# EAGLE design io (EAGLE 7.1.0)
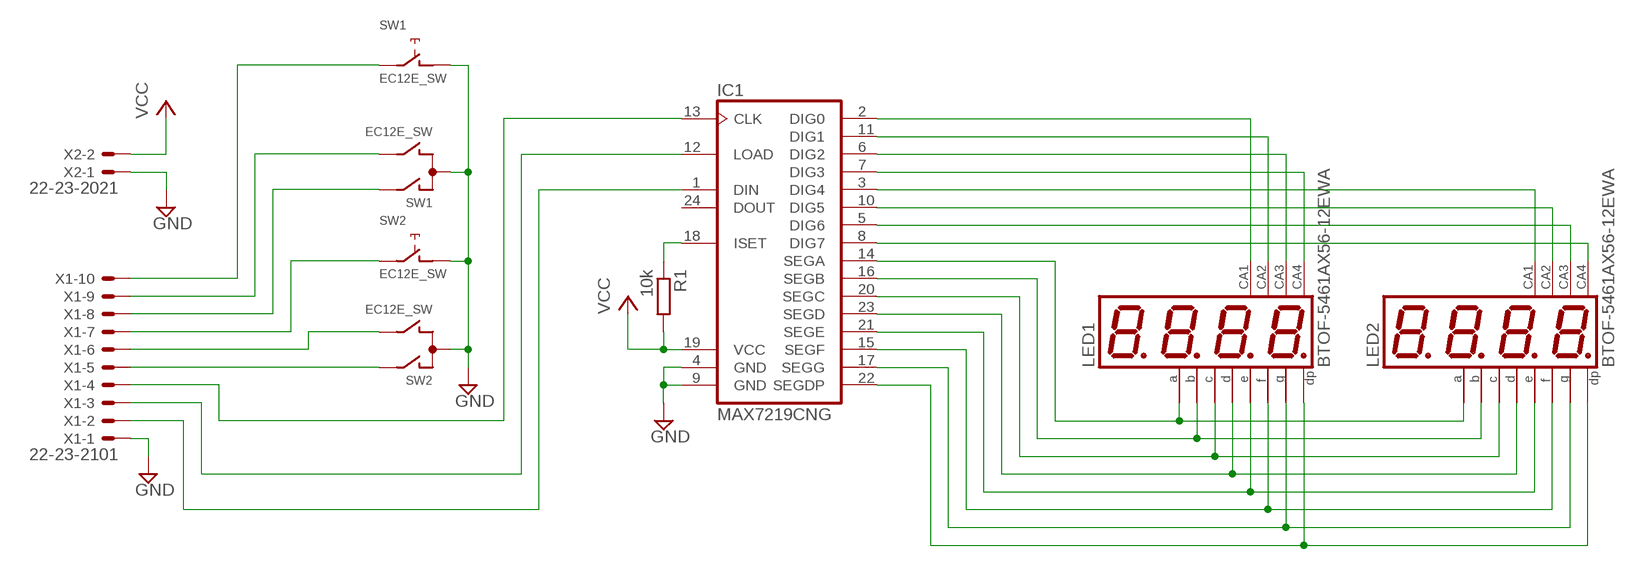
[diagram p0: schematic, sheet 1]

## Parts
IC1  MAX7219CNG  [DIL24-3]
LED1  BTOF-5461AX56-12EWA  [BX56-12]
LED2  BTOF-5461AX56-12EWA  [BX56-12]
R1  10k  R-EU_0207/10  [0207/10]
SW1  EC12E_SW  [ALPS_EC12E_SW]
SW2  EC12E_SW  [ALPS_EC12E_SW]
X1  22-23-2101  [22-23-2101]
X2  22-23-2021  [22-23-2021]

## Nets
GND: IC1.4(GND) IC1.9(GND) SW1.C SW1.D SW2.C SW2.D X1.1 X2.1
N$1: IC1.12(LOAD) X1.3
N$2: IC1.2(DIG0) LED1.12(CA)
N$3: IC1.11(DIG1) LED1.9(CA)
N$4: IC1.6(DIG2) LED1.8(CA)
N$6: IC1.3(DIG4) LED2.12(CA)
N$8: IC1.5(DIG6) LED2.8(CA)
N$9: IC1.8(DIG7) LED2.6(CA)
N$11: IC1.16(SEGB) LED1.7(B) LED2.7(B)
N$12: IC1.20(SEGC) LED1.4(C) LED2.4(C)
N$13: IC1.23(SEGD) LED1.2(D) LED2.2(D)
N$14: IC1.21(SEGE) LED1.1(E) LED2.1(E)
N$15: IC1.15(SEGF) LED1.10(F) LED2.10(F)
N$16: IC1.13(CLK) X1.4
N$17: IC1.18(ISET) R1.1
N$19: IC1.17(SEGG) LED1.5(G) LED2.5(G)
N$20: IC1.22(SEGDP) LED1.3(DP) LED2.3(DP)
N$24: IC1.1(DIN) X1.2
N$29: IC1.14(SEGA) LED1.11(A) LED2.11(A)
N$31: IC1.10(DIG5) LED2.9(CA)
N$38: SW2.E X1.7
N$39: SW1.E X1.10
N$40: SW1.B X1.9
N$41: SW2.A X1.5
N$42: SW2.B X1.6
N$45: SW1.A X1.8
N$55: IC1.7(DIG3) LED1.6(CA)
VCC: IC1.19(VCC) R1.2 X2.2
Unconnected: IC1.24(DOUT)

## Library data of the parts
IC1 = maxim:MAX7219CNG: LED DISPLAY DRIVER; MF: MAXIM; MPN: MAX7219CNG; OC_FARNELL: 1523914; OC_NEWARK: 34C4018
LED1 LED2 = TOF-5461AG-1:B?56-12*WA: 19mm (0.56INCH) FOUR DIGIT NUMERIC DISPLAY Source: http://pdf.datasheetarchive.com/datasheetsmain/Datasheets-115/DSAP001609.pdf; OC_FARNELL: unknown; OC_NEWARK: unknown
R1 = rcl:R-EU_: RESISTOR, European symbol
SW1 SW2 = switch-alps:EC12E_SW: ALPS rotary Encoder EC12E series with switch; MPN: EC12E2424407; OC_FARNELL: 1520813; OC_NEWARK: 74M1068
X1 = con-molex:22-23-2101: .100" (2.54mm) Center Header - 10 Pin; MF: MOLEX; MPN: 22-23-2101; OC_FARNELL: 1756828; OC_NEWARK: 94C0765
X2 = con-molex:22-23-2021: .100" (2.54mm) Center Header - 2 Pin; MF: MOLEX; MPN: 22-23-2021; OC_FARNELL: 1462926; OC_NEWARK: 25C3832

## Board
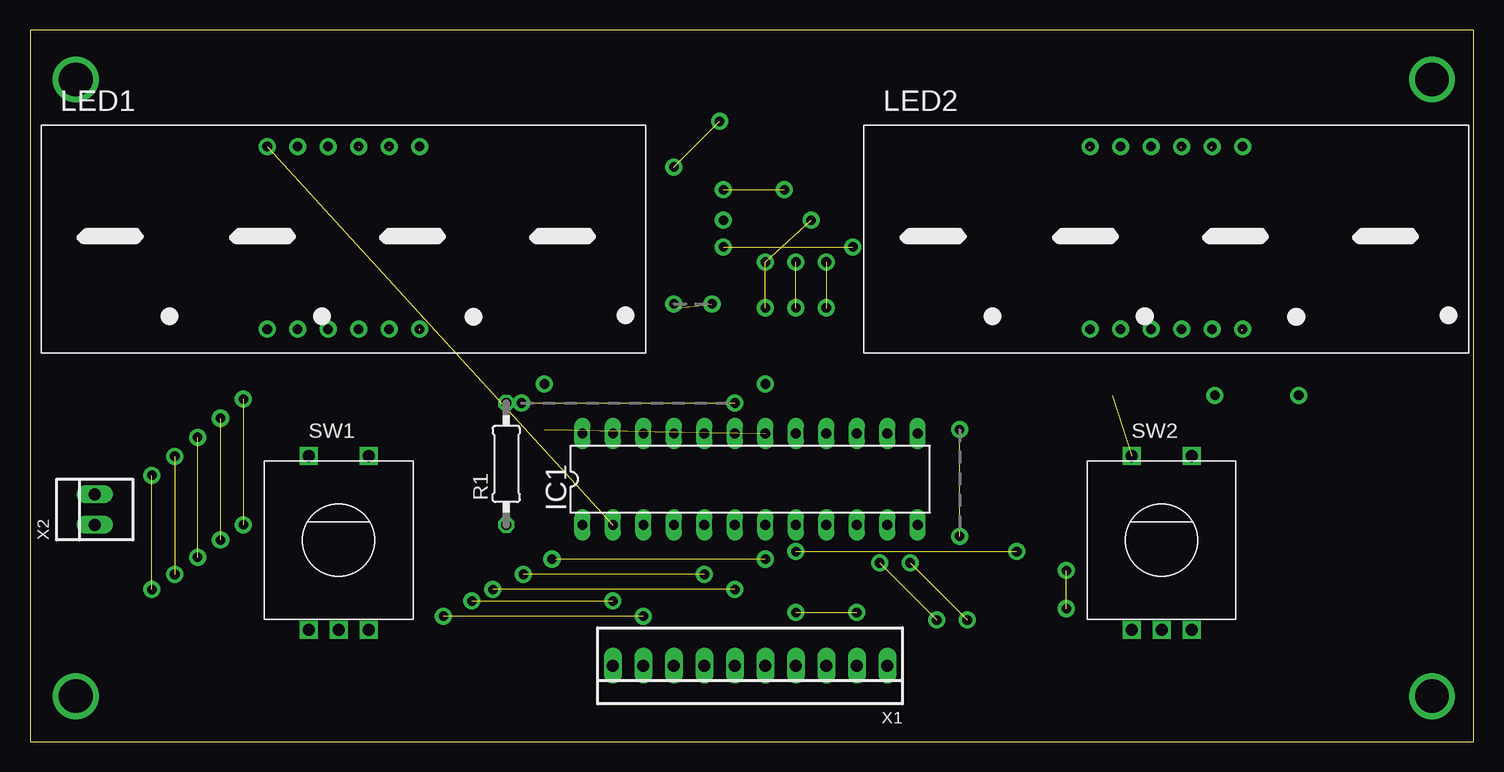
[diagram p1: board, top side]
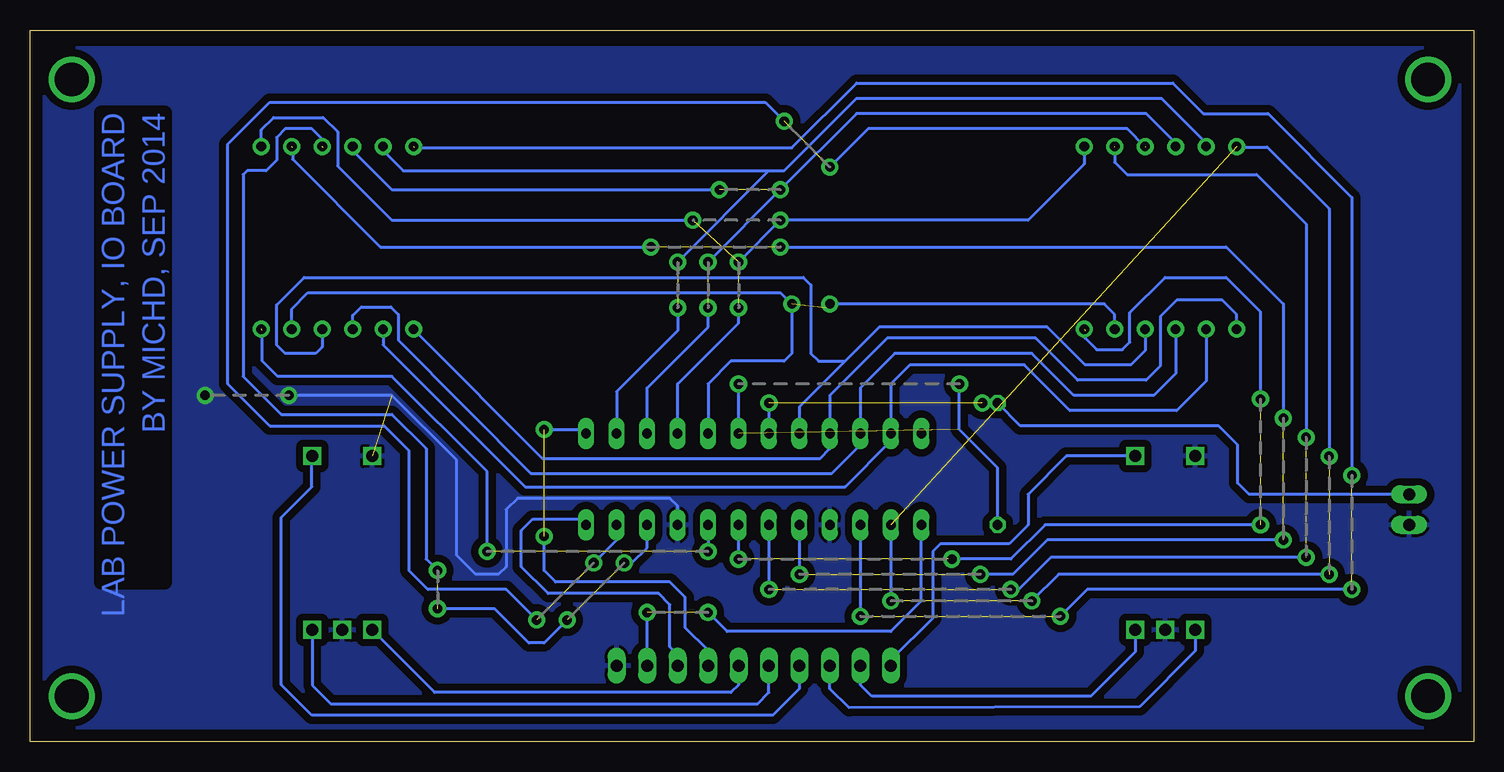
[diagram p2: board, bottom side, seen from below]

Size 120.32 x 59.36 mm. Coordinates in mm from the lower left corner, seen from the top.
Outline: 0,0 120.32,0 120.32,59.36 0,59.36 0,0
Copper layers (1*16): Top 0.035mm / dielectric 1.5mm / Bottom 0.035mm
Design rules "default": minimum track width 10mil, minimum drill 24mil, track to track 8mil, track to pad 8mil, pad to pad 8mil, via to via 8mil, smd to smd 8mil, copper to edge 40mil, drill to drill 8mil, minimum pad ring 10mil, minimum via ring 8mil, stop-mask expansion 4mil, vias tented up to drill 0mil, thermal gap 10mil

### Footprints (pad centres in the part's own frame; a part is rotated, then mirrored left to right if it is on the bottom)
DIL24-3 = drill 0.813 long: 1 -13.97,-3.81; 2 -11.43,-3.81; 3 -8.89,-3.81; 4 -6.35,-3.81; 5 -3.81,-3.81; 6 -1.27,-3.81; 7 1.27,-3.81; 8 3.81,-3.81; 9 6.35,-3.81; 10 8.89,-3.81; 11 11.43,-3.81; 12 13.97,-3.81; 13 13.97,3.81; 14 11.43,3.81; 15 8.89,3.81; 16 6.35,3.81; 17 3.81,3.81; 18 1.27,3.81; 19 -1.27,3.81; 20 -3.81,3.81; 21 -6.35,3.81; 22 -8.89,3.81; 23 -11.43,3.81; 24 -13.97,3.81
BX56-12 = drill 0.8 pad 1.422: 1 -5.95,-7.82; 2 -3.41,-7.82; 3 -0.87,-7.82; 4 1.67,-7.82; 5 4.21,-7.82; 6 6.75,-7.82; 7 6.75,7.42; 8 4.21,7.42; 9 1.67,7.42; 10 -0.87,7.42; 11 -3.41,7.42; 12 -5.95,7.42
0207/10 = drill 0.813 octagon: 1 -5.08,0; 2 5.08,0
ALPS_EC12E_SW = drill 1 square: A -2.5,-7.5; B 2.5,-7.5; C 0,-7.5; D -2.5,7; E 2.5,7
22-23-2101 = drill 1 long: 1 -11.43,0; 2 -8.89,0; 3 -6.35,0; 4 -3.81,0; 5 -1.27,0; 6 1.27,0; 7 3.81,0; 8 6.35,0; 9 8.89,0; 10 11.43,0
22-23-2021 = drill 1 long: 1 -1.27,0; 2 1.27,0

### Placement (x,y rotation side)
IC1  60.01,21.91 0 top
LED1  25.72,42.23 0 top
LED2  94.3,42.23 0 top
R1  39.69,23.18 90 top
SW1  25.72,16.83 0 top
SW2  94.3,16.83 0 top
X1  60.01,6.35 180 top
X2  5.4,19.37 90 top

### Tracks (layer width: path | path; a pad name or v marks a point on that pad's centre or on a via)
GND  (via drill 0.8 pad 1.42)  (1 unrouted)
  Bottom 0.254: 66.36,17.78 66.36,19.68 66.99,20.32 79.69,20.32 80.64,19.37 80.64,14.61 81.28,13.97 83.19,13.97 84.77,15.56 84.77,23.5 90.17,28.89 v98.74,28.89 98.74,28.57
  other vias: 105.73,28.89
  pour Bottom (isolate 0.61): 0.64,57.78 119.7,57.78 119.7,0.64 0.64,0.64
N$1
  Bottom 0.254: X1.3 66.36,7.3 66.99,7.94 66.99,11.43 67.94,12.38 77.15,12.38 79.38,14.61 79.38,17.62 78.42,18.57 74.45,18.57 IC1.12
N$2  (1 unrouted)
N$3  (via drill 0.8 pad 1.42)  (3 unrouted)
  Bottom 0.254: IC1.11 71.44,16.83 v73.34,14.92 | v78.11,10.16 80.64,12.7 87.15,12.7 88.74,14.29 88.74,24.29 90.81,26.35 100.33,26.35 103.82,29.84 103.82,49.85 100.33,53.34 59.05,53.34 v57.47,51.75 | 27.38,49.61 28.89,51.12 50.48,51.12 v53.66,47.94
N$4  (via drill 0.8 pad 1.42)  (3 unrouted)
  Bottom 0.254: IC1.6 v58.74,12.7 | v13.97,15.4 35.24,15.4 37.94,12.7 v38.58,12.7 | 29.92,49.61 29.92,48.34 28.89,47.31 18.1,47.31 13.97,43.18 v13.97,25.4
N$5  (via drill 2.8 pad 3.81)
  other vias: 3.81,3.81
N$6  (via drill 0.8 pad 1.42)  (3 unrouted)
  Bottom 0.254: IC1.3 51.12,10.48 | v10.16,12.7 32.23,12.7 v34.45,10.48 | 88.27,49.53 56.83,49.53 51.44,54.93 25.08,54.93 22.54,52.39 17.14,52.39 10.16,45.4 v10.16,22.23
N$7  (via drill 2.8 pad 3.81)
  other vias: 3.81,55.24
N$8  (via drill 0.8 pad 1.42)  (4 unrouted)
  Bottom 0.254: IC1.5 v56.2,13.97 | v15.88,16.83 35.56,16.83 38.42,13.97 v41.12,13.97 | v57.78,41.27 20.64,41.27 15.88,36.51 15.88,26.99 | 98.42,49.53 98.42,48.58 91.12,41.27 v68.58,41.27
N$9  (via drill 0.8 pad 1.42)  (2 unrouted)
  Bottom 0.254: IC1.8 v63.82,15.88 | v82.23,15.88 82.23,22.54 90.17,30.48 99.69,30.48 100.97,31.75 100.97,34.29
N$10  (via drill 0.8 pad 1.42)
  other vias: 62.87,46.04
N$11  (via drill 0.8 pad 1.42)  (2 unrouted)
  Bottom 0.254: 61.28,40.01 v57.78,43.5 37.15,43.5 32.47,48.18 LED1.7 | IC1.16 66.36,29.84 61.28,34.92 v61.28,36.2 | LED2.7 101.05,51.03 100.01,52.07 95.89,52.07 94.69,50.88 94.69,48.02 90.17,43.5 65.09,43.5
N$12
  Bottom 0.254: LED1.4 27.39,32.62 28.57,31.43 32.38,31.43 35.56,34.61 49.53,34.61 52.39,31.75 | 52.39,31.75 56.2,27.94 IC1.20 | LED2.4 95.97,32.94 96.52,32.38 99.06,32.38 99.77,33.1 99.77,36.43 97.47,38.73 55.88,38.73 55.24,38.1 55.24,32.38 54.61,31.75 52.39,31.75
N$13
  Bottom 0.254: LED1.2 22.31,30.08 24.77,27.62 33.66,27.62 37.47,31.43 46.99,31.43 48.58,29.84 IC1.23 48.58,25.08 52.39,21.27 79.06,21.27 90.89,33.1 LED2.2
N$14
  Bottom 0.254: LED2.1 88.06,34.09 77.63,23.65 54.45,23.65 53.66,24.45 IC1.21 53.66,28.89 48.9,33.66 36.51,33.66 33.02,30.16 27.3,30.16 26.11,31.35 26.11,35.48 24.77,36.83 20.95,36.83 19.77,35.64 LED1.1
N$15  (via drill 0.8 pad 1.42)  (2 unrouted)
  Bottom 0.254: LED1.10 24.85,49.93 27.3,52.39 51.44,52.39 v57.78,46.04 v63.82,40.01 | IC1.15 68.9,29.53 63.82,34.61 v63.82,36.2 | LED2.10 93.43,49.3 90.17,46.04 62.87,46.04
N$16  (via drill 0.8 pad 1.42)  (1 unrouted)
  Bottom 0.254: v77.47,26.04 74.3,26.04 IC1.13 | X1.4 63.82,7.62 65.72,9.53 65.72,12.06 66.99,13.34 76.52,13.34 77.47,14.29 77.47,17.14
N$17  (1 unrouted)
  Bottom 0.254: 42.86,29.84 42.86,26.04 39.69,22.86 R1.1 | IC1.18 61.28,29.84
N$18  (via drill 0.8 pad 1.42)
  other vias: 42.86,29.84
N$19  (via drill 0.8 pad 1.42)  (1 unrouted)
  Bottom 0.254: LED2.5 98.51,36.11 97.16,37.47 57.78,37.47 v56.83,36.51 56.83,32.38 57.47,31.75 61.91,31.75 63.82,29.84 IC1.17 | LED1.5 29.93,35.64 30.8,36.51 v53.66,36.51 53.98,36.2
N$20
  Bottom 0.254: LED1.3 24.85,30.71 26.67,28.89 33.34,28.89 36.83,32.38 48.26,32.38 51.12,29.53 IC1.22 51.12,24.77 53.5,22.38 78.58,22.38 89.61,33.5 89.61,35.64 90.25,36.27 92.71,36.27 93.43,35.56 LED2.3
N$21  (via drill 0.8 pad 1.42)
  other vias: 61.28,29.84
N$22  (via drill 2.8 pad 3.81)
  other vias: 116.84,55.24
N$23  (via drill 0.8 pad 1.42)
  other vias: 77.47,17.14
N$24  (via drill 0.8 pad 1.42)  (1 unrouted)
  Bottom 0.254: X1.2 v68.9,10.79 | IC1.1 46.04,11.75 48.58,9.21 62.23,9.21 v63.82,10.79
N$25  (via drill 0.8 pad 1.42)
  other vias: 61.28,40.01
N$27  (via drill 0.8 pad 1.42)
  other vias: 66.36,40.01
N$28  (via drill 0.8 pad 1.42)
  other vias: 65.09,43.5
N$29  (via drill 0.8 pad 1.42)  (1 unrouted)
  Bottom 0.254: v66.36,36.2 66.36,34.29 71.44,29.21 IC1.14 | LED1.11 22.31,49.93 26.04,53.66 51.44,53.66 57.47,47.62 58.74,47.62 | 58.74,47.62 66.36,40.01 | LED2.11 90.89,49.3 89.22,47.62 58.74,47.62
N$30  (via drill 2.8 pad 3.81)
  other vias: 116.84,3.81
N$31  (via drill 0.8 pad 1.42)  (3 unrouted)
  Bottom 0.254: v70.8,14.92 70.17,14.92 68.9,16.19 IC1.10 | v75.56,10.16 77.47,8.26 78.74,8.26 81.6,11.11 v86.36,11.11 | 95.89,49.53 95.89,50.16 96.84,51.12 99.06,51.12 99.77,50.4 99.77,48.5 100.65,47.62 102.23,47.62 102.55,47.31 102.55,30.48 99.38,27.3 90.17,27.3 87.31,24.45 87.31,15.24 v86.36,14.29
N$38
  Bottom 0.254: X1.7 56.2,4.45 58.42,2.22 96.84,2.22 99.38,4.76 99.38,18.73 96.84,21.27 96.84,23.79 SW2.E
N$39
  Bottom 0.254: SW1.E 33.96,23.83 37.15,20.64 37.15,18.1 38.73,16.51 44.45,16.51 45.09,15.88 45.09,10.32 48.58,6.83 X1.10
N$40
  Bottom 0.254: SW1.B 28.22,7.5 31.91,3.81 50.16,3.81 51.12,4.76 X1.9
N$41
  Bottom 0.254: X1.5 61.28,4.76 61.91,4.13 86.6,4.13 SW2.A
N$42
  Bottom 0.254: SW2.B 96.8,4.72 95.25,3.17 59.69,3.17 58.74,4.13 X1.6
N$45
  Bottom 0.254: SW1.A 23.22,7.58 27.86,2.94 52.07,2.86 53.66,4.45 X1.8
N$51  (via drill 0.8 pad 1.42)
  other vias: 15.88,26.99
N$55  (via drill 0.8 pad 1.42)  (3 unrouted)
  Bottom 0.254: v61.28,15.24 IC1.7 | v17.78,18.1 35.72,18.1 38.58,15.24 v43.5,15.24 43.81,15.24 | 32.38,34.29 32.38,33.66 31.43,32.7 29.29,32.7 28.65,33.34 28.65,35.8 25.72,38.73 20.64,38.73 17.78,35.88 v17.78,28.57
N$57  (via drill 0.8 pad 1.42)
  other vias: 48.58,11.75
N$59  (via drill 0.8 pad 1.42)
  other vias: 51.12,10.48
N$61  (via drill 0.8 pad 1.42)  (2 unrouted)
  Bottom 0.254: 48.58,18.1 48.58,11.75 | v12.06,13.97 34.61,13.97 v36.83,11.75 | 19.68,49.61 17.22,49.61 12.06,44.45 v12.06,23.81
VCC  (via drill 0.8 pad 1.42)  (1 unrouted)
  Bottom 0.254: v40.96,28.26 R1.2 37.78,26.35 21.27,26.35 19.68,24.77 19.68,21.59 18.73,20.64 X2.2 | v58.74,28.26 IC1.19

### Text on the board
Bottom: LAB POWER SUPPLY, IO BOARD / BY MICHD, SEP 2014